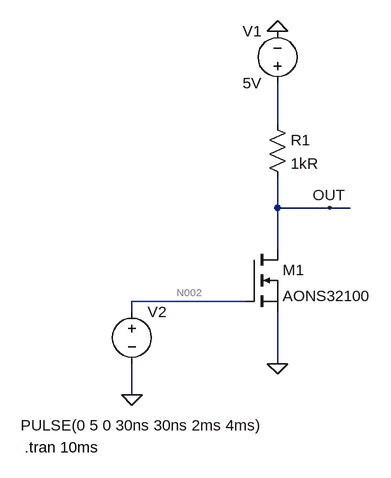
[diagram p0: schematic nMos.asc]
nMos.asc, the LTspice schematic file:
Version 4
SHEET 1 880 680
WIRE 224 64 224 0
WIRE 224 192 224 144
WIRE 304 192 224 192
WIRE 336 192 304 192
WIRE 224 256 224 192
WIRE 176 336 0 336
WIRE 0 352 0 336
WIRE 224 432 224 352
WIRE 0 480 0 432
FLAG 224 432 0
FLAG 224 -80 0
FLAG 0 480 0
FLAG 304 192 OUT
SYMBOL voltage 224 16 R180
WINDOW 0 24 96 Left 2
WINDOW 3 24 16 Left 2
WINDOW 123 0 0 Left 0
WINDOW 39 0 0 Left 0
SYMATTR InstName V1
SYMATTR Value 5V
SYMBOL voltage 0 336 R0
WINDOW 3 -171 191 Left 2
WINDOW 123 0 0 Left 0
WINDOW 39 0 0 Left 0
SYMATTR InstName V2
SYMATTR Value PULSE(0 5 0 30ns 30ns 2ms 4ms)
SYMBOL nmos 176 256 R0
SYMATTR InstName M1
SYMATTR Value AONS32100
SYMBOL res 208 48 R0
SYMATTR InstName R1
SYMATTR Value 1kR
TEXT -165 561 Left 2 !.tran 10ms

The netlist it stands for:
* nMos.asc
V1 N001 0 5V
V2 N002 0 PULSE(0 5 0 30ns 30ns 2ms 4ms)
M1 OUT N002 0 0 AONS32100
R1 N001 OUT 1kR
.model NMOS NMOS
.model PMOS PMOS
.lib standard.mos
.tran 10ms
.backanno
.end

* Results of the author's LTspice run, read from the files saved beside the schematic
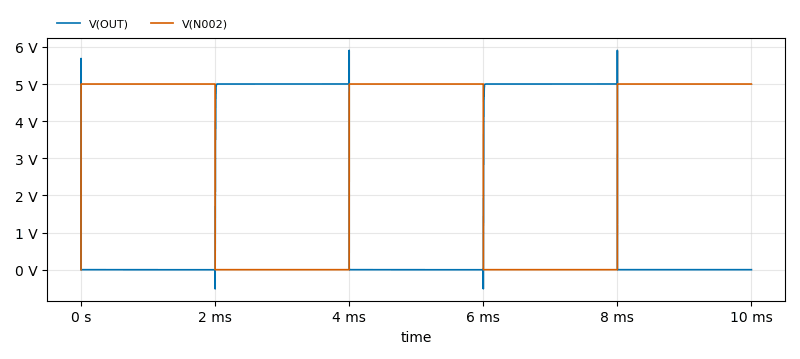
[diagram p1: Transient Analysis of nMos.asc, plotted from the saved traces]
* Transient Analysis, 1 run:
*   V(OUT): min -514.9 mV, max 5.907 V, average 1.995 V, rms 3.156 V, last 4.587 µV
*   V(N002): min 0 V, max 5 V, average 3 V, rms 3.873 V, last 5 V